# EAGLE design POV_02 (EAGLE 8.7.1)
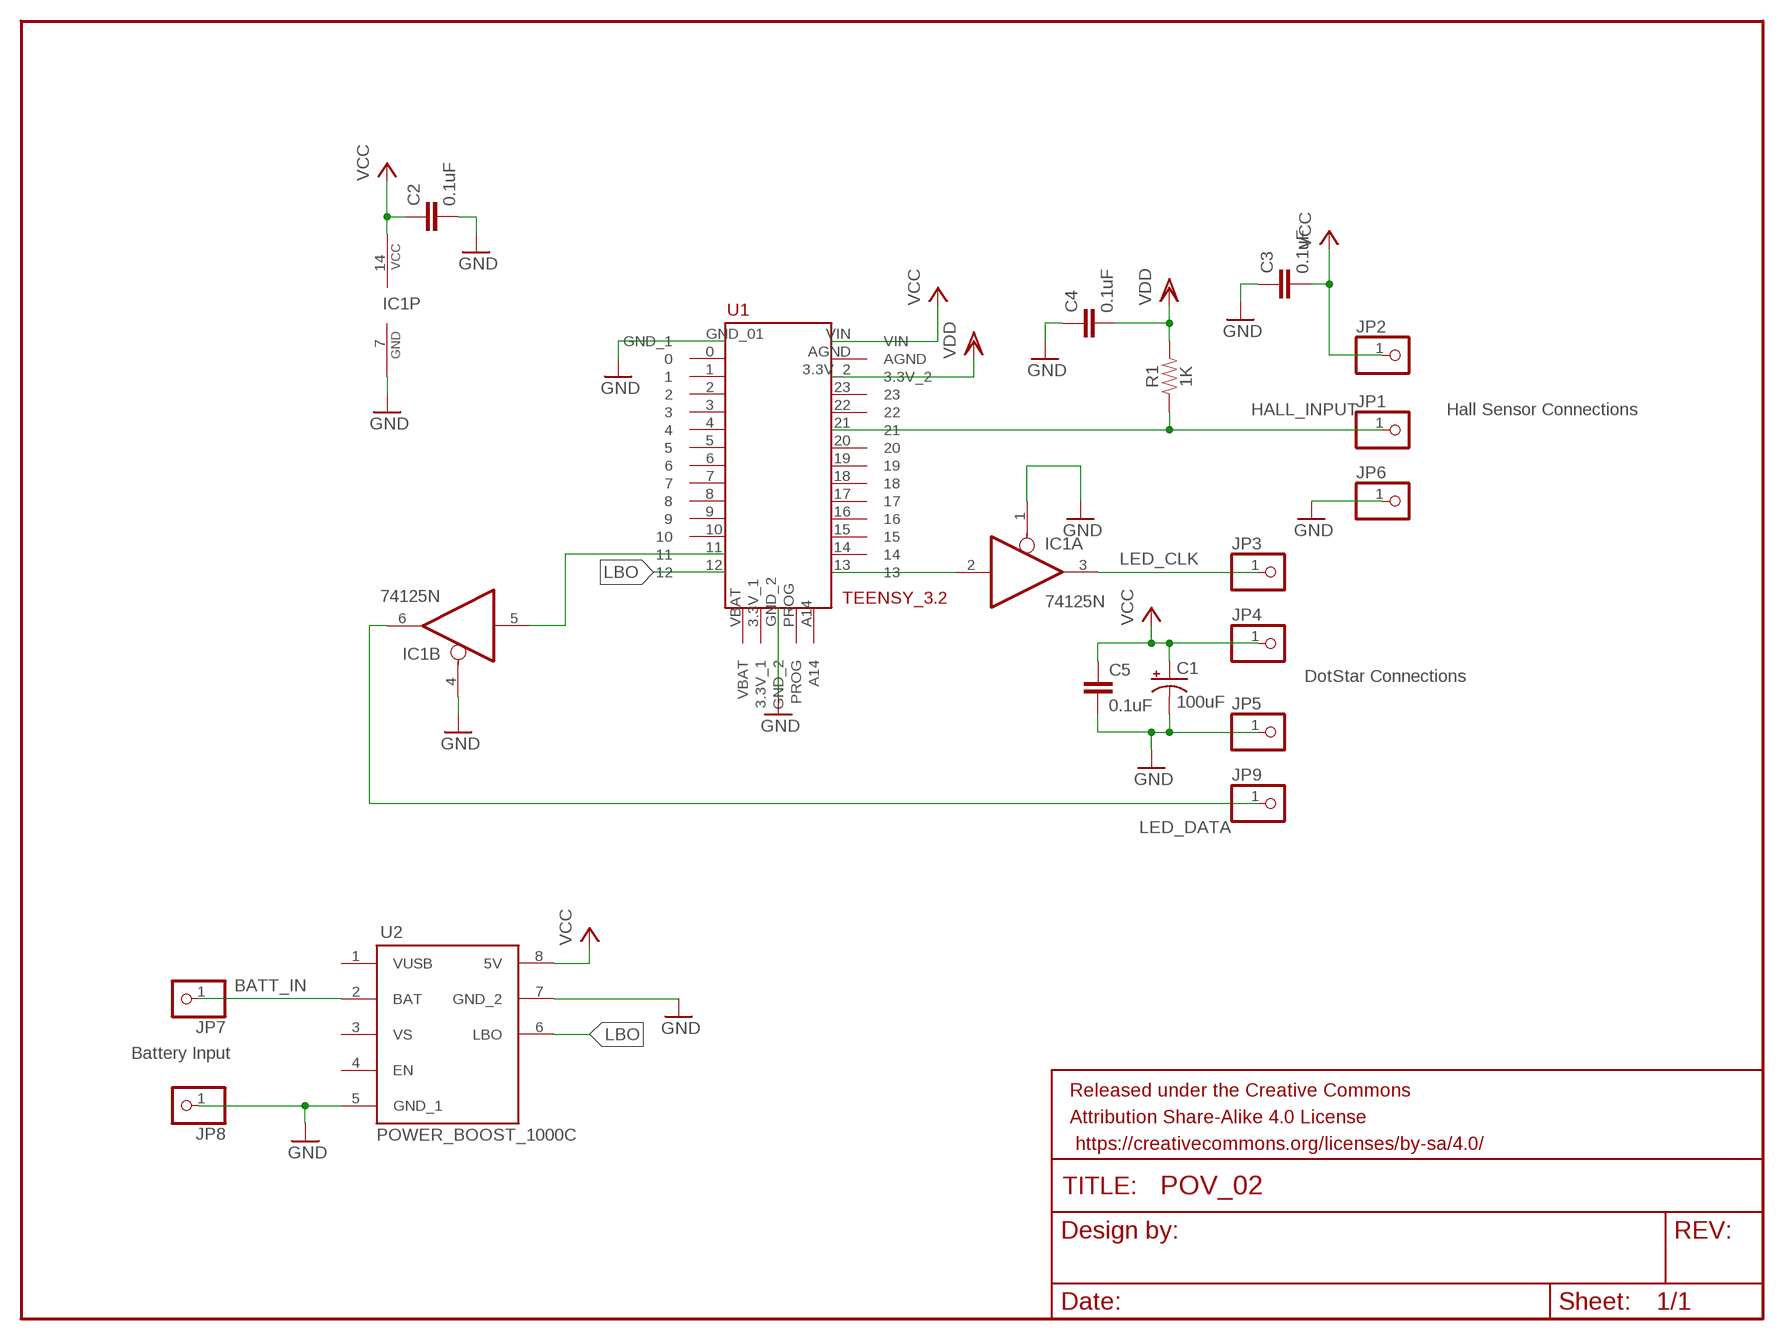
[diagram p0: schematic, sheet 1]

## Parts
C1  100uF  100UF-POLAR-RADIAL-2.5MM-25V-20%  [CPOL-RADIAL-2.5MM-6.5MM]
C2  0.1uF  0.1UF-KIT-EZ-50V-20%  [CAP-PTH-SMALL-KIT]
C3  0.1uF  0.1UF-KIT-EZ-50V-20%  [CAP-PTH-SMALL-KIT]
C4  0.1uF  0.1UF-KIT-EZ-50V-20%  [CAP-PTH-SMALL-KIT]
C5  0.1uF  0.1UF-KIT-EZ-50V-20%  [CAP-PTH-SMALL-KIT]
FRAME1  FRAME-LETTERNO_PACKAGE  [DUMMY]
IC1  74125N  [DIL14]
JP1  HEADER-1X1ROUND  [1X01_ROUND]
JP2  HEADER-1X1ROUND  [1X01_ROUND]
JP3  HEADER-1X1ROUND  [1X01_ROUND]
JP4  HEADER-1X1ROUND  [1X01_ROUND]
JP5  HEADER-1X1ROUND  [1X01_ROUND]
JP6  HEADER-1X1ROUND  [1X01_ROUND]
JP7  HEADER-1X1ROUND  [1X01_ROUND]
JP8  HEADER-1X1ROUND  [1X01_ROUND]
JP9  HEADER-1X1ROUND  [1X01_ROUND]
R1  1K  RESISTORAXIAL-0.3  [AXIAL-0.3]
U1  TEENSY_3.2  [TEENSEY_3.2]
U2  POWER_BOOST_1000C  [POWER_BOOST_1000C]

## Nets
BATT_IN: JP7.1 U2.2(BAT)
GND: C1.2(-) C2.2 C3.1 C4.1 C5.2 IC1.1(A:OE) IC1.4(B:OE) IC1.7(P:GND) JP5.1 JP6.1 JP8.1 U1.GND_01(GND_1) U1.GND_2 U2.5(GND_1) U2.7(GND_2)
HALL_INPUT: JP1.1 R1.P$1 U1.21
LBO: U1.12 U2.6(LBO)
LED_CLK: IC1.3(A:O) JP3.1
LED_DATA: IC1.6(B:O) JP9.1
N$1: IC1.2(A:I) U1.13
N$3: IC1.5(B:I) U1.11
VCC: C1.1(+) C2.1 C3.2 C5.1 IC1.14(P:VCC) JP2.1 JP4.1 U1.VIN U2.8(5V)
VDD: C4.2 R1.P$2 U1.3.3V_2
Unconnected: IC1.8(C:O) IC1.9(C:I) IC1.10(C:OE) IC1.11(D:O) IC1.12(D:I) IC1.13(D:OE) U1.0 U1.1 U1.2 U1.3 U1.3.3V_1 U1.4 U1.5 U1.6 U1.7 U1.8 U1.9 U1.10 U1.14 U1.15 U1.16 U1.17 U1.18 U1.19 U1.20 U1.22 U1.23 U1.A14 U1.AGND U1.PROG U1.VBAT U2.1(VUSB) U2.3(VS) U2.4(EN)

## Notes on the sheet
- Hall Sensor Connections
- DotStar Connections
- Battery Input

## Library data of the parts
C1 = SparkFun-Capacitors:100UF-POLAR: 100µF polarized capacitors A capacitor is a passive two-terminal electrical component used to store electrical energy temporarily in an electric field.; PROD_ID: CAP-08439
C2-C5 = SparkFun-Capacitors:0.1UF: 0.1µF ceramic capacitors A capacitor is a passive two-terminal electrical component used to store electrical energy temporarily in an electric field.; PROD_ID: CAP-08370
FRAME1 = SparkFun-Aesthetics:FRAME-LETTER: Schematic Frame - Letter Standard 8.5x11 US Letter frame; DESIGNER: Nobody; VERSION: v01
IC1 = 74xx-us:74*125: Quad bus BUFFER, 3-state
JP1-JP9 = microbuilder:HEADER-1X1: PIN HEADER
R1 = SparkFun-Resistors:RESISTOR: Generic Resistor Package
U1 = GFV:TEENSY_3.2
U2 = GFV:POWER_BOOST_1000C

## Board
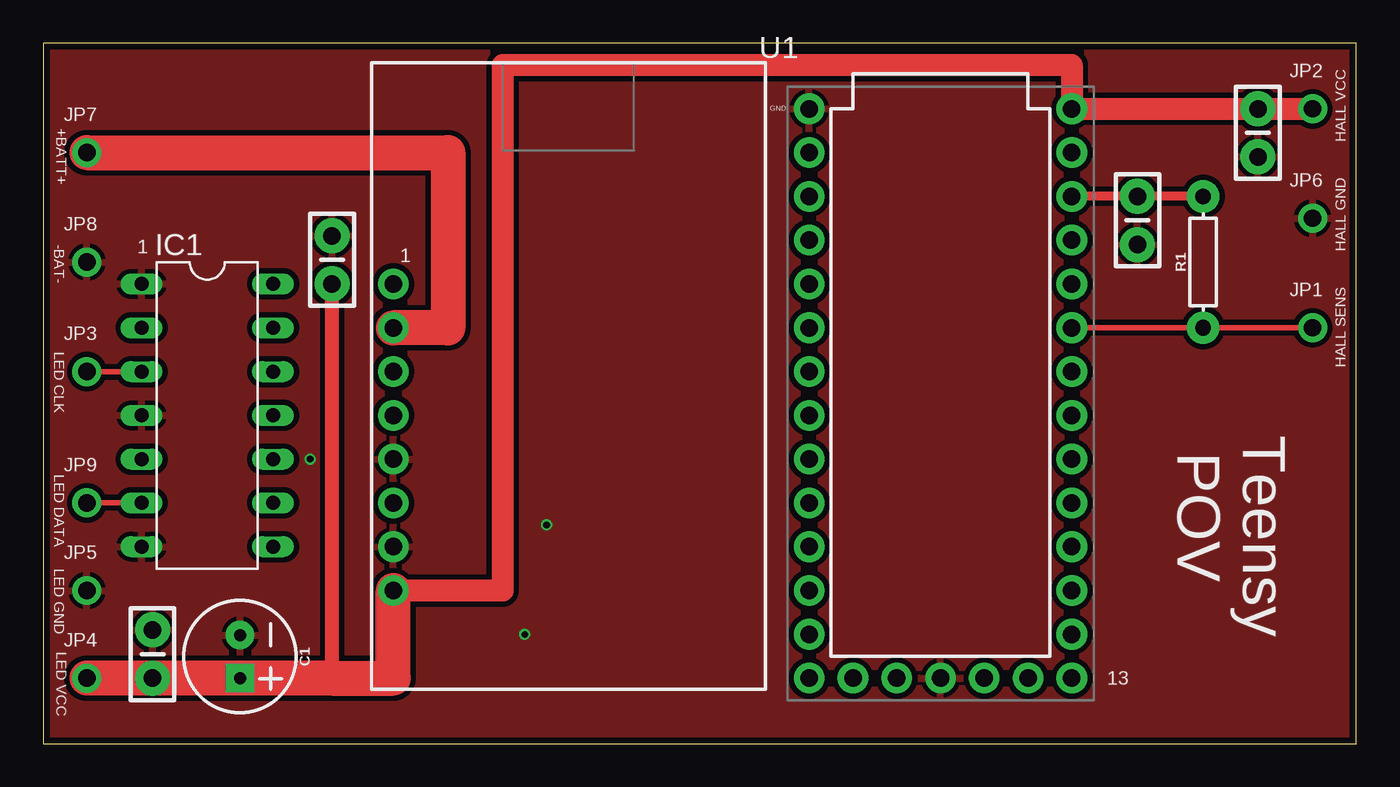
[diagram p1: board, top side]
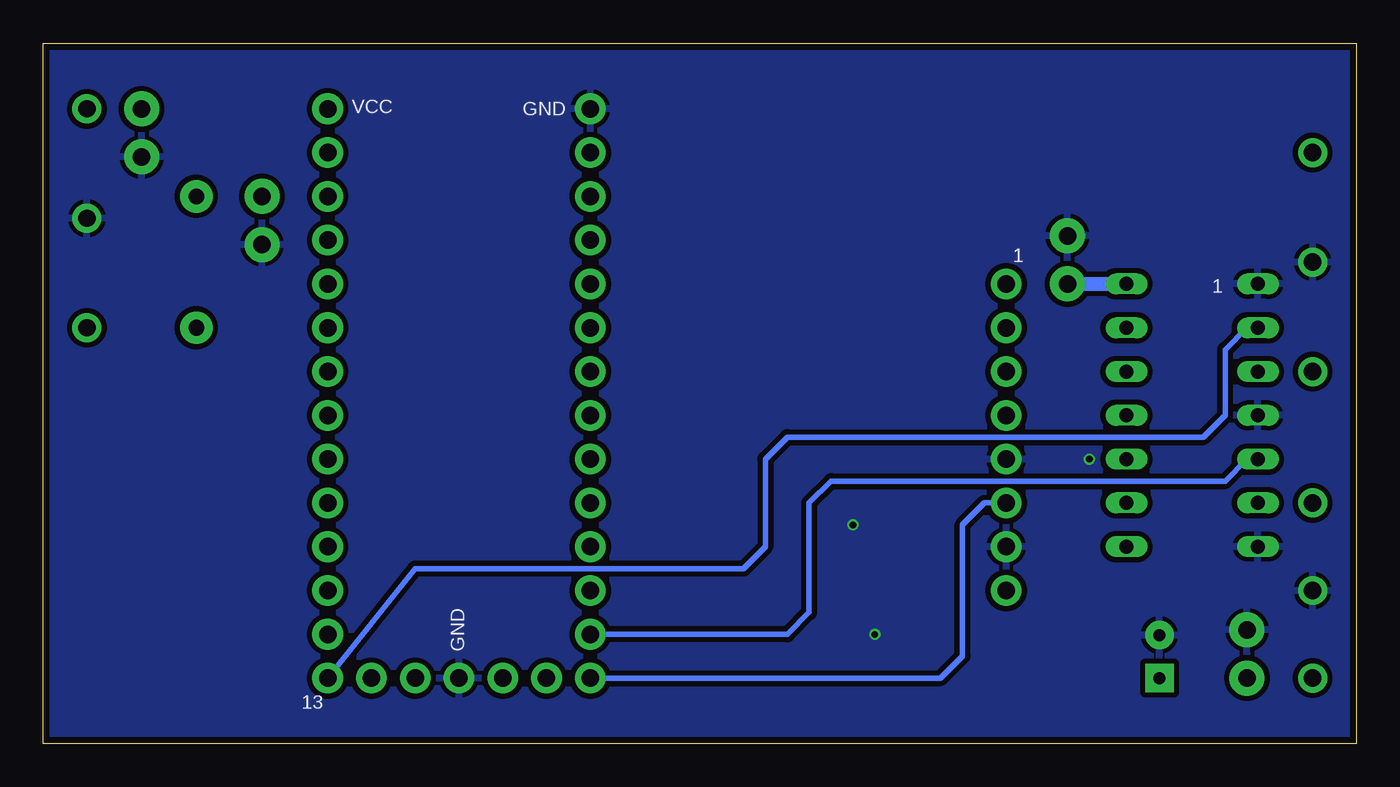
[diagram p2: board, bottom side, seen from below]

Size 76.2 x 40.64 mm. Coordinates in mm from the lower left corner, seen from the top.
Outline: 0,0 76.2,0 76.2,40.64 0,40.64 0,0
Copper layers (1*16): Top 0.035559375mm / dielectric 1.6mm / Bottom 0.035559375mm
Design rules "oshpark-2layer": minimum track width 6mil, minimum drill 10mil, track to track 6mil, track to pad 6mil, pad to pad 6mil, via to via 6mil, smd to smd 6mil, copper to edge 15mil, drill to drill 6mil, minimum pad ring 5mil, minimum via ring 5mil, stop-mask expansion 2.5mil, vias tented up to drill 0mil, thermal gap 10mil

### Footprints (pad centres in the part's own frame; a part is rotated, then mirrored left to right if it is on the bottom)
CPOL-RADIAL-2.5MM-6.5MM = drill 0.7 pad 1.651 square: 1 1.25,0 | drill 0.7 pad 1.651: 2 -1.25,0
CAP-PTH-SMALL-KIT = drill 1.016 pad 2.032: 1 -1.397,0; 2 1.397,0
DIL14 = drill 0.813 long: 1 -7.62,-3.81; 2 -5.08,-3.81; 3 -2.54,-3.81; 4 0,-3.81; 5 2.54,-3.81; 6 5.08,-3.81; 7 7.62,-3.81; 8 7.62,3.81; 9 5.08,3.81; 10 2.54,3.81; 11 0,3.81; 12 -2.54,3.81; 13 -5.08,3.81; 14 -7.62,3.81
1X01_ROUND = drill 1 pad 1.676: 1 0,0
AXIAL-0.3 = drill 0.9 pad 1.88: P$1 -3.81,0; P$2 3.81,0
TEENSEY_3.2 = drill 1.016 pad 1.778: 0 -7.62,13.97; 1 -7.62,11.43; 2 -7.62,8.89; 3 -7.62,6.35; 3.3V_1 -2.54,-16.51; 3.3V_2 7.62,11.43; 4 -7.62,3.81; 5 -7.62,1.27; 6 -7.62,-1.27; 7 -7.62,-3.81; 8 -7.62,-6.35; 9 -7.62,-8.89; 10 -7.62,-11.43; 11 -7.62,-13.97; 12 -7.62,-16.51; 13 7.62,-16.51; 14 7.62,-13.97; 15 7.62,-11.43; 16 7.62,-8.89; 17 7.62,-6.35; 18 7.62,-3.81; 19 7.62,-1.27; 20 7.62,1.27; 21 7.62,3.81; 22 7.62,6.35; 23 7.62,8.89; A14 5.08,-16.51; AGND 7.62,13.97; GND_01 -7.62,16.51; GND_2 0,-16.51; PROG 2.54,-16.51; VBAT -5.08,-16.51; VIN 7.62,16.51
POWER_BOOST_1000C = drill 1.016 pad 1.778: 1 12.827,1.27; 2 15.367,1.27; 3 17.907,1.27; 4 20.447,1.27; 5 22.987,1.27; 6 25.527,1.27; 7 28.067,1.27; 8 30.607,1.27

### Placement (x,y rotation side)
C1  11.43,5.05 270 top
C2  16.76,28.07 90 top
C3  70.48,35.43 90 top
C4  63.5,30.35 90 top
C5  6.35,5.21 90 top
FRAME1  0,40.64 0 top
IC1  9.53,19.05 270 top
JP1  73.66,24.13 0 top
JP2  73.66,36.83 0 top
JP3  2.54,21.59 0 top
JP4  2.54,3.81 0 top
JP5  2.54,8.89 0 top
JP6  73.66,30.48 0 top
JP7  2.54,34.29 0 top
JP8  2.54,27.94 0 top
JP9  2.54,13.97 0 top
R1  67.31,27.94 90 top
U1  52.07,20.32 0 top
U2  19.05,39.5 270 top

### Tracks (layer width: path | path; a pad name or v marks a point on that pad's centre or on a via)
BATT_IN
  Top 2.032: JP7.1 23.5,34.29 23.5,24.13 U2.2
GND  (via drill 0.38)
  other vias: 15.49,16.51 29.21,12.7 27.94,6.35
  pour Top (isolate 0.305): 0,0 0,40.64 76.2,40.64 76.2,0
  pour Bottom (isolate 0.305): 0,0 0,40.64 76.2,40.64 76.2,0
HALL_INPUT
  Top 0.305: JP1.1 R1.P$1 U1.21
LBO
  Bottom 0.305: U1.12 24.13,3.81 22.86,5.08 22.86,12.7 21.59,13.97 U2.6
LED_CLK
  Top 0.305: JP3.1 IC1.3
LED_DATA
  Top 0.305: IC1.6 JP9.1
N$1
  Bottom 0.305: U1.13 54.61,10.16 35.56,10.16 34.29,11.43 34.29,16.51 33.02,17.78 8.89,17.78 7.62,19.05 7.62,22.86 6.35,24.13 IC1.2
N$3
  Bottom 0.305: IC1.5 6.35,16.51 7.62,15.24 30.48,15.24 31.75,13.97 31.75,7.62 33.02,6.35 U1.11
VCC
  Top 0.813: 16.76,3.81 C2.1
  Top 1.27: JP2.1 C3.2 U1.VIN 59.69,39.37 26.67,39.37 26.67,8.89 U2.8
  Top 1.524: C1.1 | C5.1
  Top 2.032: C1.1 16.76,3.81 20.32,3.81 U2.8 | C1.1 C5.1 | C5.1 JP4.1
  Bottom 0.813: C2.1 IC1.14
VDD
  Top 0.508: U1.3.3V_2 C4.2 R1.P$2

### Text on the board
tPlace: GND | +BATT+ | HALL VCC | -BAT- | HALL GND | 1 | 1 | LED CLK | HALL SENS | Teensy / POV | LED DATA | LED GND | LED VCC | 13
bPlace: VCC | GND | 1 | 1 | GND | 13